# Altium schematic sheet LOGIC.SchDoc: LOGIC
size OrCAD A; ApprovedBy: Abbas Mahmoud; CheckedBy: Abbas Mahmoud; Author: Abbas Mahmoud; CompanyName: lsa 4wya :); DrawnBy: Abbas Mahmoud; Engineer: Abbas Mahmoud; DocumentNumber: 4; Revision: 1; SheetNumber: 4; SheetTotal: 8
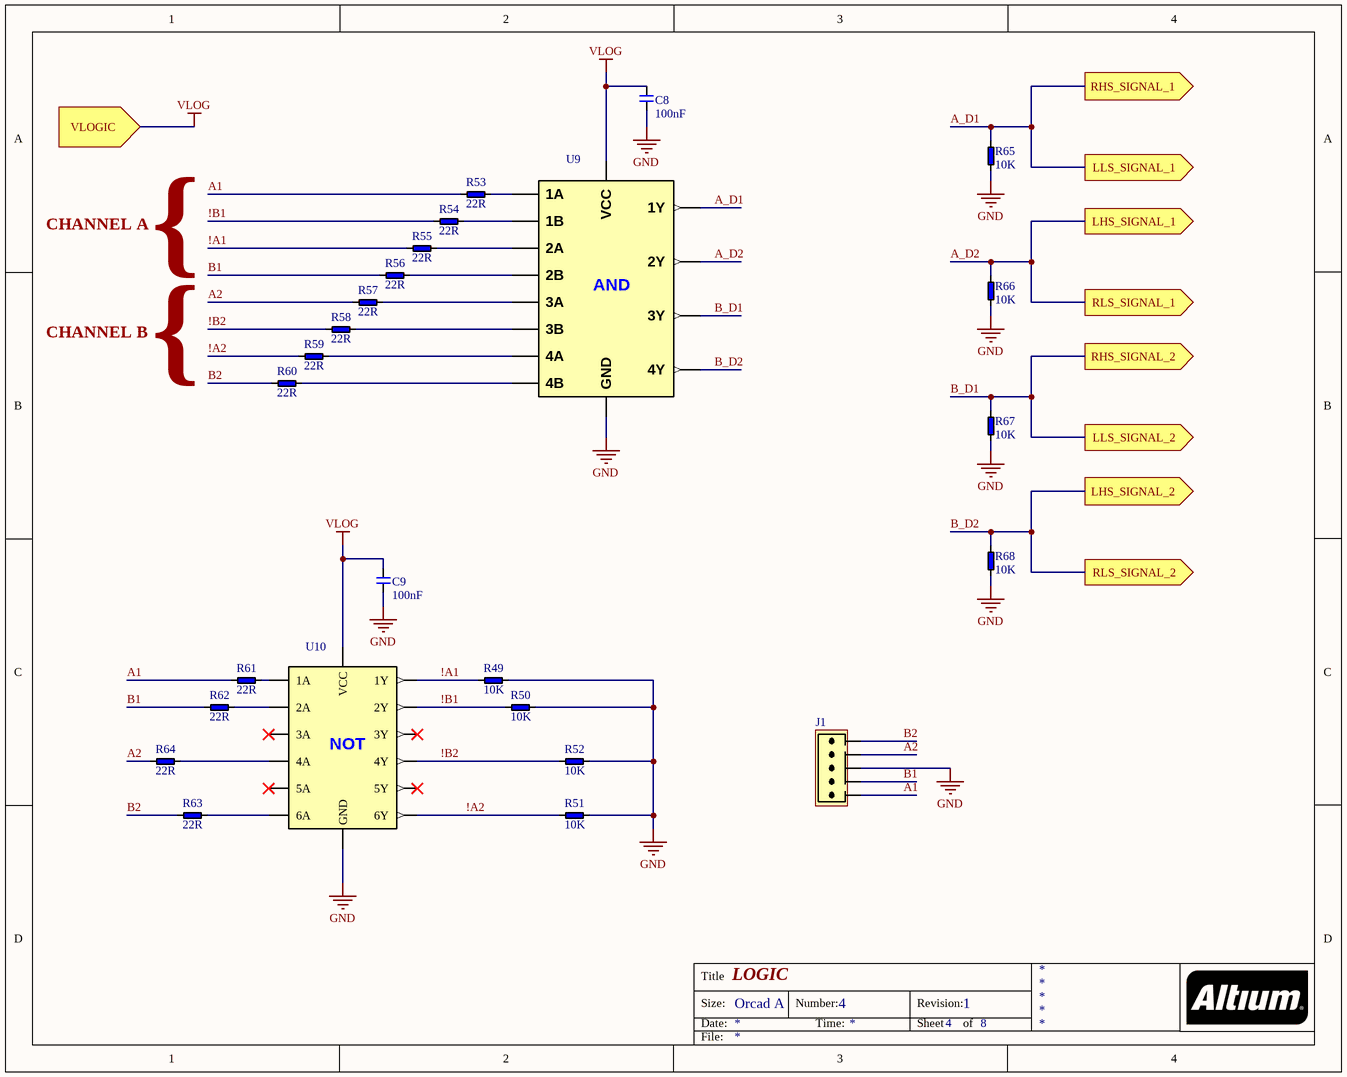
[diagram p0: LOGIC.SchDoc]

## Parts
C8  100nF  [CCAP 0.1 N Y]
C9  100nF  [CCAP 0.1 N Y]
J1  DATA CONNECTOR *5  [MOLEX *5_DATA CONNECTOR]  (value not drawn)
R49  10K  [RESISTOR _9]
R50  10K  [RESISTOR _9]
R51  10K  [RESISTOR _9]
R52  10K  [RESISTOR _9]
R53  22R  [RESISTOR _9]
R54  22R  [RESISTOR _9]
R55  22R  [RESISTOR _9]
R56  22R  [RESISTOR _9]
R57  22R  [RESISTOR _9]
R58  22R  [RESISTOR _9]
R59  22R  [RESISTOR _9]
R60  22R  [RESISTOR _9]
R61  22R  [RESISTOR _9]
R62  22R  [RESISTOR _9]
R63  22R  [RESISTOR _9]
R64  22R  [RESISTOR _9]
R65  10K  [RESISTOR _9]
R66  10K  [RESISTOR _9]
R67  10K  [RESISTOR _9]
R68  10K  [RESISTOR _9]
U9  SN74F08N  [IC X14 PIN]  (value not drawn)
U10  SN7404N  [IC X14 PIN]  (value not drawn)

## Ports
LHS_SIGNAL_1 (out), LHS_SIGNAL_2 (out), LLS_SIGNAL_1 (out), LLS_SIGNAL_2 (out), RHS_SIGNAL_1 (out), RHS_SIGNAL_2 (out), RLS_SIGNAL_1 (out), RLS_SIGNAL_2 (out), VLOGIC (in)

## Nets
GND: C8.2 C9.2 J1.3 R49.2 R50.2 R51.2 R52.2 R65.1 R66.1 R67.1 R68.1 U9.7(GND) U10.7(GND)
VLOG: C8.1 C9.1 U9.14(VCC) U10.14(VCC) ; port VLOGIC
!A1: R49.1 R55.1 U10.2(1Y)
!A2: R51.1 R59.1 U10.12(6Y)
!B1: R50.1 R54.1 U10.4(2Y)
!B2: R52.1 R58.1 U10.8(4Y)
A1: J1.5 R53.1 R61.1
A2: J1.2 R57.1 R64.1
A_D1: R65.2 U9.3(1Y) ; port RHS_SIGNAL_1, port LLS_SIGNAL_1
A_D2: R66.2 U9.6(2Y) ; port LHS_SIGNAL_1, port RLS_SIGNAL_1
B1: J1.4 R56.1 R62.1
B2: J1.1 R60.1 R63.1
B_D1: R67.2 U9.8(3Y) ; port RHS_SIGNAL_2, port LLS_SIGNAL_2
B_D2: R68.2 U9.11(4Y) ; port LHS_SIGNAL_2, port RLS_SIGNAL_2
NetR53_2: R53.2 U9.1(1A)
NetR54_2: R54.2 U9.2(1B)
NetR55_2: R55.2 U9.4(2A)
NetR56_2: R56.2 U9.5(2B)
NetR57_2: R57.2 U9.9(3A)
NetR58_2: R58.2 U9.10(3B)
NetR59_2: R59.2 U9.12(4A)
NetR60_2: R60.2 U9.13(4B)
NetR61_2: R61.2 U10.1(1A)
NetR62_2: R62.2 U10.3(2A)
NetR63_2: R63.2 U10.13(6A)
NetR64_2: R64.2 U10.9(4A)

Not connected (* = marked no-connect by the designer): U10 5(3A)* 6(3Y)* 10(5Y)* 11(5A)*

## Notes on the sheet
- CHANNEL A
- {
- CHANNEL B
- Title
- Size:
- Date:
- Orcad A
- Number:
- Time:
- Revision:
- Sheet
- of
- File:
- (in symbol 7404  (NOT)) NOT
- (in symbol 7408  (AND)) AND

## Library data of the parts
C8 C9 = CERAMIC CAP
J1 = DATA CONNECTOR *5: Data Cable JST 5-pin
R49-R68 = RESISTOR
U9 = 7408  (AND): AND Gate 4-Element 2-IN Bipolar 14-Pin PDIP AND Gate 4-Element 2-IN Bipolar 14-Pin PDIP; MF: Texas Instruments; MP: SN74F08N; Price: 0.36 USD; SnapEDA_Link: https://www.snapeda.com/parts/SN74F08N/Texas%20Instruments/view-part/?ref=snap; Package: DIP-14 Texas Instruments; Availability: Good; Value: *
U10 = 7404  (NOT): Inverter 6-Element Bipolar 14-Pin PDIP Tube; MF: Texas Instruments; Price: 1.26 USD; SnapEDA_Link: https://www.snapeda.com/parts/SN7404N/Texas%20Instruments/view-part/?ref=snap; MP: SN7404N; Availability: Good; Package: DIP-14 Texas Instruments; Value: *